# Altium schematic sheet CPU.SchDoc
size 420 x 297 mm; SheetNumber: 9; SheetTotal: 32; DocumentTypeShort: Э3; DocumentInvertoryNumber: ㅤ
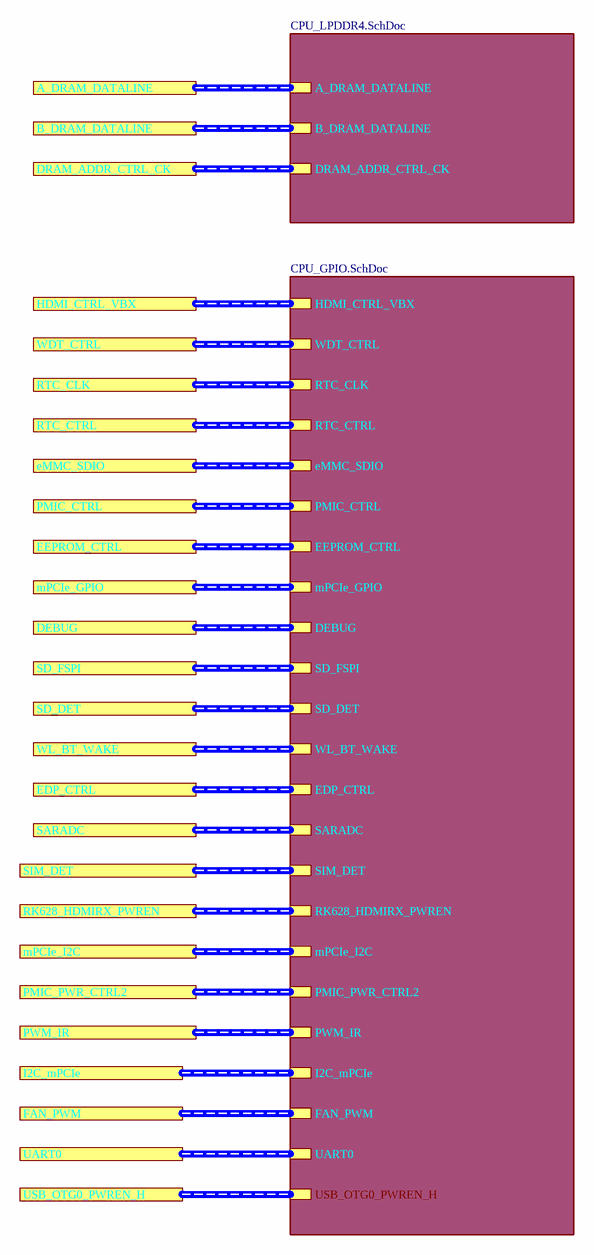
[diagram p0: CPU.SchDoc]

## Sub-sheets
CPU_GPIO = CPU_GPIO.SchDoc: HDMI_CTRL_VBX (harness HDMI_CTRL_VBX), WDT_CTRL (harness WDT_CTRL), RTC_CLK (harness RTC_CLK), RTC_CTRL (harness RTC_CTRL), eMMC_SDIO (harness eMMC_SDIO), PMIC_CTRL (harness PMIC_CTRL), EEPROM_CTRL (harness EEPROM_CTRL), SD_FSPI (harness SD_FSPI), SD_DET (harness SD_DET), WL_BT_WAKE (harness WL_BT_WAKE), EDP_CTRL (harness EDP_CTRL), SARADC (harness SARADC), mPCIe_GPIO (harness mPCIe_GPIO), SIM_DET (harness SIM_DET), mPCIe_I2C (harness mPCIe_I2C), RK628_HDMIRX_PWREN (harness RK628_HDMIRX_PWREN), PMIC_PWR_CTRL2 (harness PMIC_PWR_CTRL2), PWM_IR (harness PWM0_IR), I2C_mPCIe (harness I2C_mPCIe), DEBUG (harness DEBUG), FAN_PWM (harness FAN_PWM), UART0 (harness UART0), USB_OTG0_PWREN_H (harness USB_OTG0_PWREN_H)
CPU_LPDDR4 = CPU_LPDDR4.SchDoc: A_DRAM_DATALINE (harness A_DRAM_DATALINE), B_DRAM_DATALINE (harness B_DRAM_DATALINE), DRAM_ADDR_CTRL_CK (harness DRAM_ADDR_CTRL_CK)

## Ports
A_DRAM_DATALINE, B_DRAM_DATALINE, DEBUG, DRAM_ADDR_CTRL_CK, EDP_CTRL, EEPROM_CTRL, eMMC_SDIO, FAN_PWM, HDMI_CTRL_VBX, I2C_mPCIe, mPCIe_GPIO, mPCIe_I2C, PMIC_CTRL, PMIC_PWR_CTRL2, PWM_IR, RK628_HDMIRX_PWREN, RTC_CLK, RTC_CTRL, SARADC, SD_DET, SD_FSPI, SIM_DET, UART0, USB_OTG0_PWREN_H, WDT_CTRL, WL_BT_WAKE

## Buses and harness runs
harness port A_DRAM_DATALINE = sheet CPU_LPDDR4/A_DRAM_DATALINE
harness port B_DRAM_DATALINE = sheet CPU_LPDDR4/B_DRAM_DATALINE
harness port DEBUG = sheet CPU_GPIO/DEBUG
harness port DRAM_ADDR_CTRL_CK = sheet CPU_LPDDR4/DRAM_ADDR_CTRL_CK
harness port EDP_CTRL = sheet CPU_GPIO/EDP_CTRL
harness port EEPROM_CTRL = sheet CPU_GPIO/EEPROM_CTRL
harness port eMMC_SDIO = sheet CPU_GPIO/eMMC_SDIO
harness port FAN_PWM = sheet CPU_GPIO/FAN_PWM
harness port HDMI_CTRL_VBX = sheet CPU_GPIO/HDMI_CTRL_VBX
harness port I2C_mPCIe = sheet CPU_GPIO/I2C_mPCIe
harness port mPCIe_GPIO = sheet CPU_GPIO/mPCIe_GPIO
harness port mPCIe_I2C = sheet CPU_GPIO/mPCIe_I2C
harness port PMIC_CTRL = sheet CPU_GPIO/PMIC_CTRL
harness port PMIC_PWR_CTRL2 = sheet CPU_GPIO/PMIC_PWR_CTRL2
harness port PWM_IR = sheet CPU_GPIO/PWM_IR
harness port RK628_HDMIRX_PWREN = sheet CPU_GPIO/RK628_HDMIRX_PWREN
harness port RTC_CLK = sheet CPU_GPIO/RTC_CLK
harness port RTC_CTRL = sheet CPU_GPIO/RTC_CTRL
harness port SARADC = sheet CPU_GPIO/SARADC
harness port SD_DET = sheet CPU_GPIO/SD_DET
harness port SD_FSPI = sheet CPU_GPIO/SD_FSPI
harness port SIM_DET = sheet CPU_GPIO/SIM_DET
harness port UART0 = sheet CPU_GPIO/UART0
harness port USB_OTG0_PWREN_H = sheet CPU_GPIO/USB_OTG0_PWREN_H
harness port WDT_CTRL = sheet CPU_GPIO/WDT_CTRL
harness port WL_BT_WAKE = sheet CPU_GPIO/WL_BT_WAKE

## Notes on the sheet
- Подп. и дата
- Инв. № дубл.
- Взам. инв. №
- Инв. № подл.
- Изм.
- Лист
- № докум.
- Подп.
- Дата
- Копировал
- Формат А3